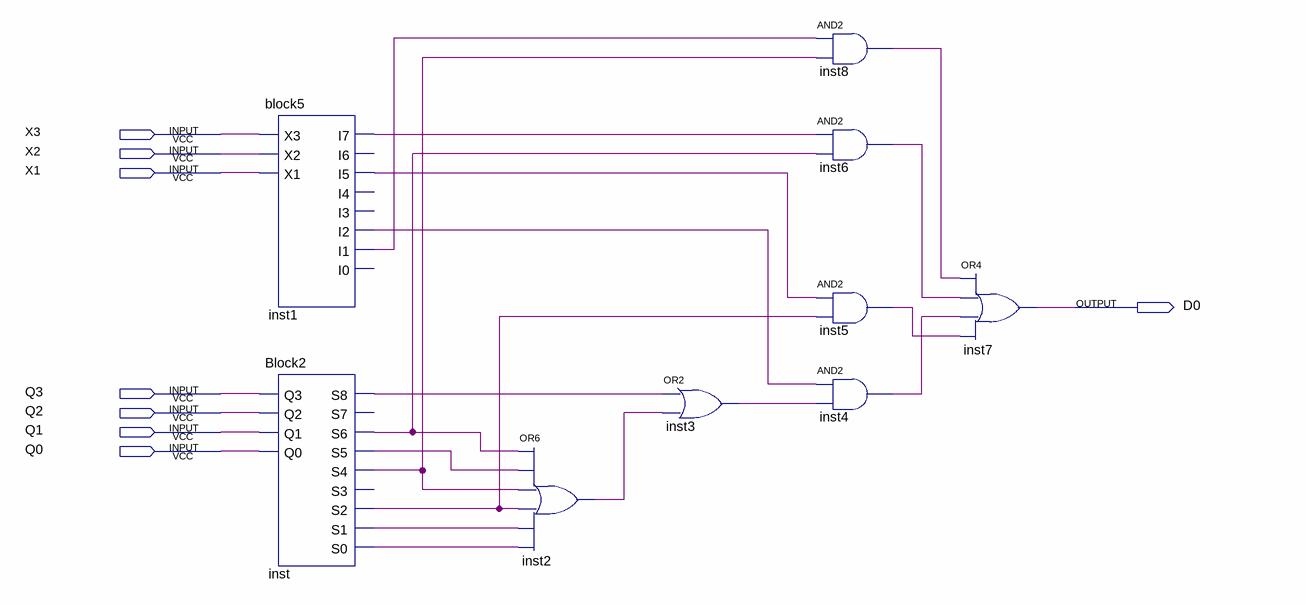
[diagram p0: schematic sheet]
// Quartus schematic block9.bdf as structural Verilog: 9 symbols, 8 pins
module block9 (
  input  X3,
  input  X2,
  input  X1,
  input  Q3,
  input  Q2,
  input  Q1,
  input  Q0,
  output D0
);

  wire inst1_i1, inst1_i2, inst1_i5, inst1_i7, inst2_out, inst3_out, inst4_out, inst5_out, inst6_out,
       inst8_out, inst_s0, inst_s1, inst_s2, inst_s4, inst_s5, inst_s6, inst_s8;

  block5 inst1 (
    .X3(X3), .X2(X2), .X1(X1), .I7(inst1_i7), .I5(inst1_i5), .I2(inst1_i2), .I1(inst1_i1));  // open: I6, I4, I3, I0
  Block2 inst (
    .Q3(Q3), .Q2(Q2), .Q1(Q1), .Q0(Q0), .S8(inst_s8), .S6(inst_s6), .S5(inst_s5), .S4(inst_s4), .S2(inst_s2),
    .S1(inst_s1), .S0(inst_s0));  // open: S7, S3
  or inst2 (inst2_out, inst_s6, inst_s5, inst_s4, inst_s2, inst_s1, inst_s0);
  or inst3 (inst3_out, inst_s8, inst2_out);
  and inst8 (inst8_out, inst1_i1, inst_s4);
  and inst6 (inst6_out, inst1_i7, inst_s6);
  and inst5 (inst5_out, inst1_i5, inst_s2);
  and inst4 (inst4_out, inst1_i2, inst3_out);
  or inst7 (D0, inst8_out, inst6_out, inst4_out, inst5_out);
endmodule
